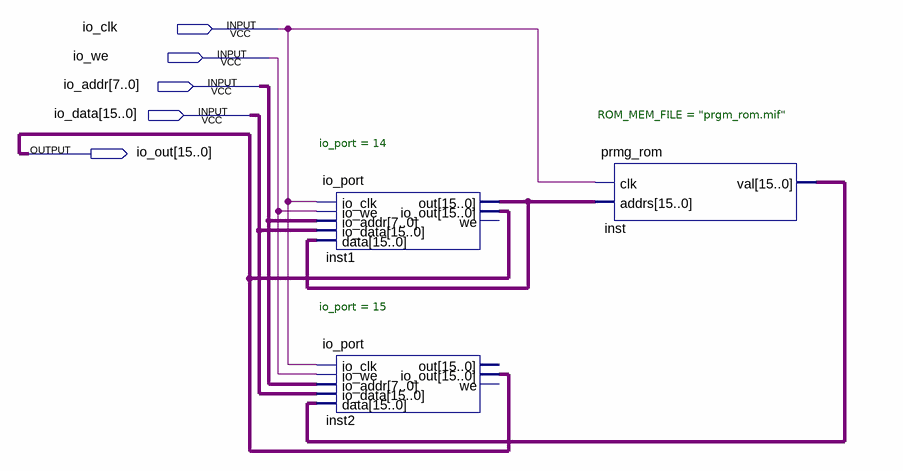
[diagram p0: schematic sheet]
// Quartus schematic prgm_rom_io.bdf as structural Verilog: 3 symbols, 5 pins
module prgm_rom_io (
  input  io_clk,
  input  io_we,
  input  [7:0] io_addr,
  input  [15:0] io_data,
  output [15:0] io_out
);

  wire [15:0] inst1_out, inst_val;

  io_port #(.io_port(14)) inst1 (
    .io_clk(io_clk), .io_we(io_we), .io_addr(io_addr), .io_data(io_data), .data(inst1_out), .out(inst1_out),
    .io_out(io_out));  // open: we
  io_port #(.io_port(15)) inst2 (
    .io_clk(io_clk), .io_we(io_we), .io_addr(io_addr), .io_data(io_data), .data(inst_val), .io_out(io_out));  // open: out, we
  prmg_rom #(.ROM_MEM_FILE("prgm_rom.mif")) inst (.clk(io_clk), .addrs(inst1_out), .val(inst_val));
endmodule
